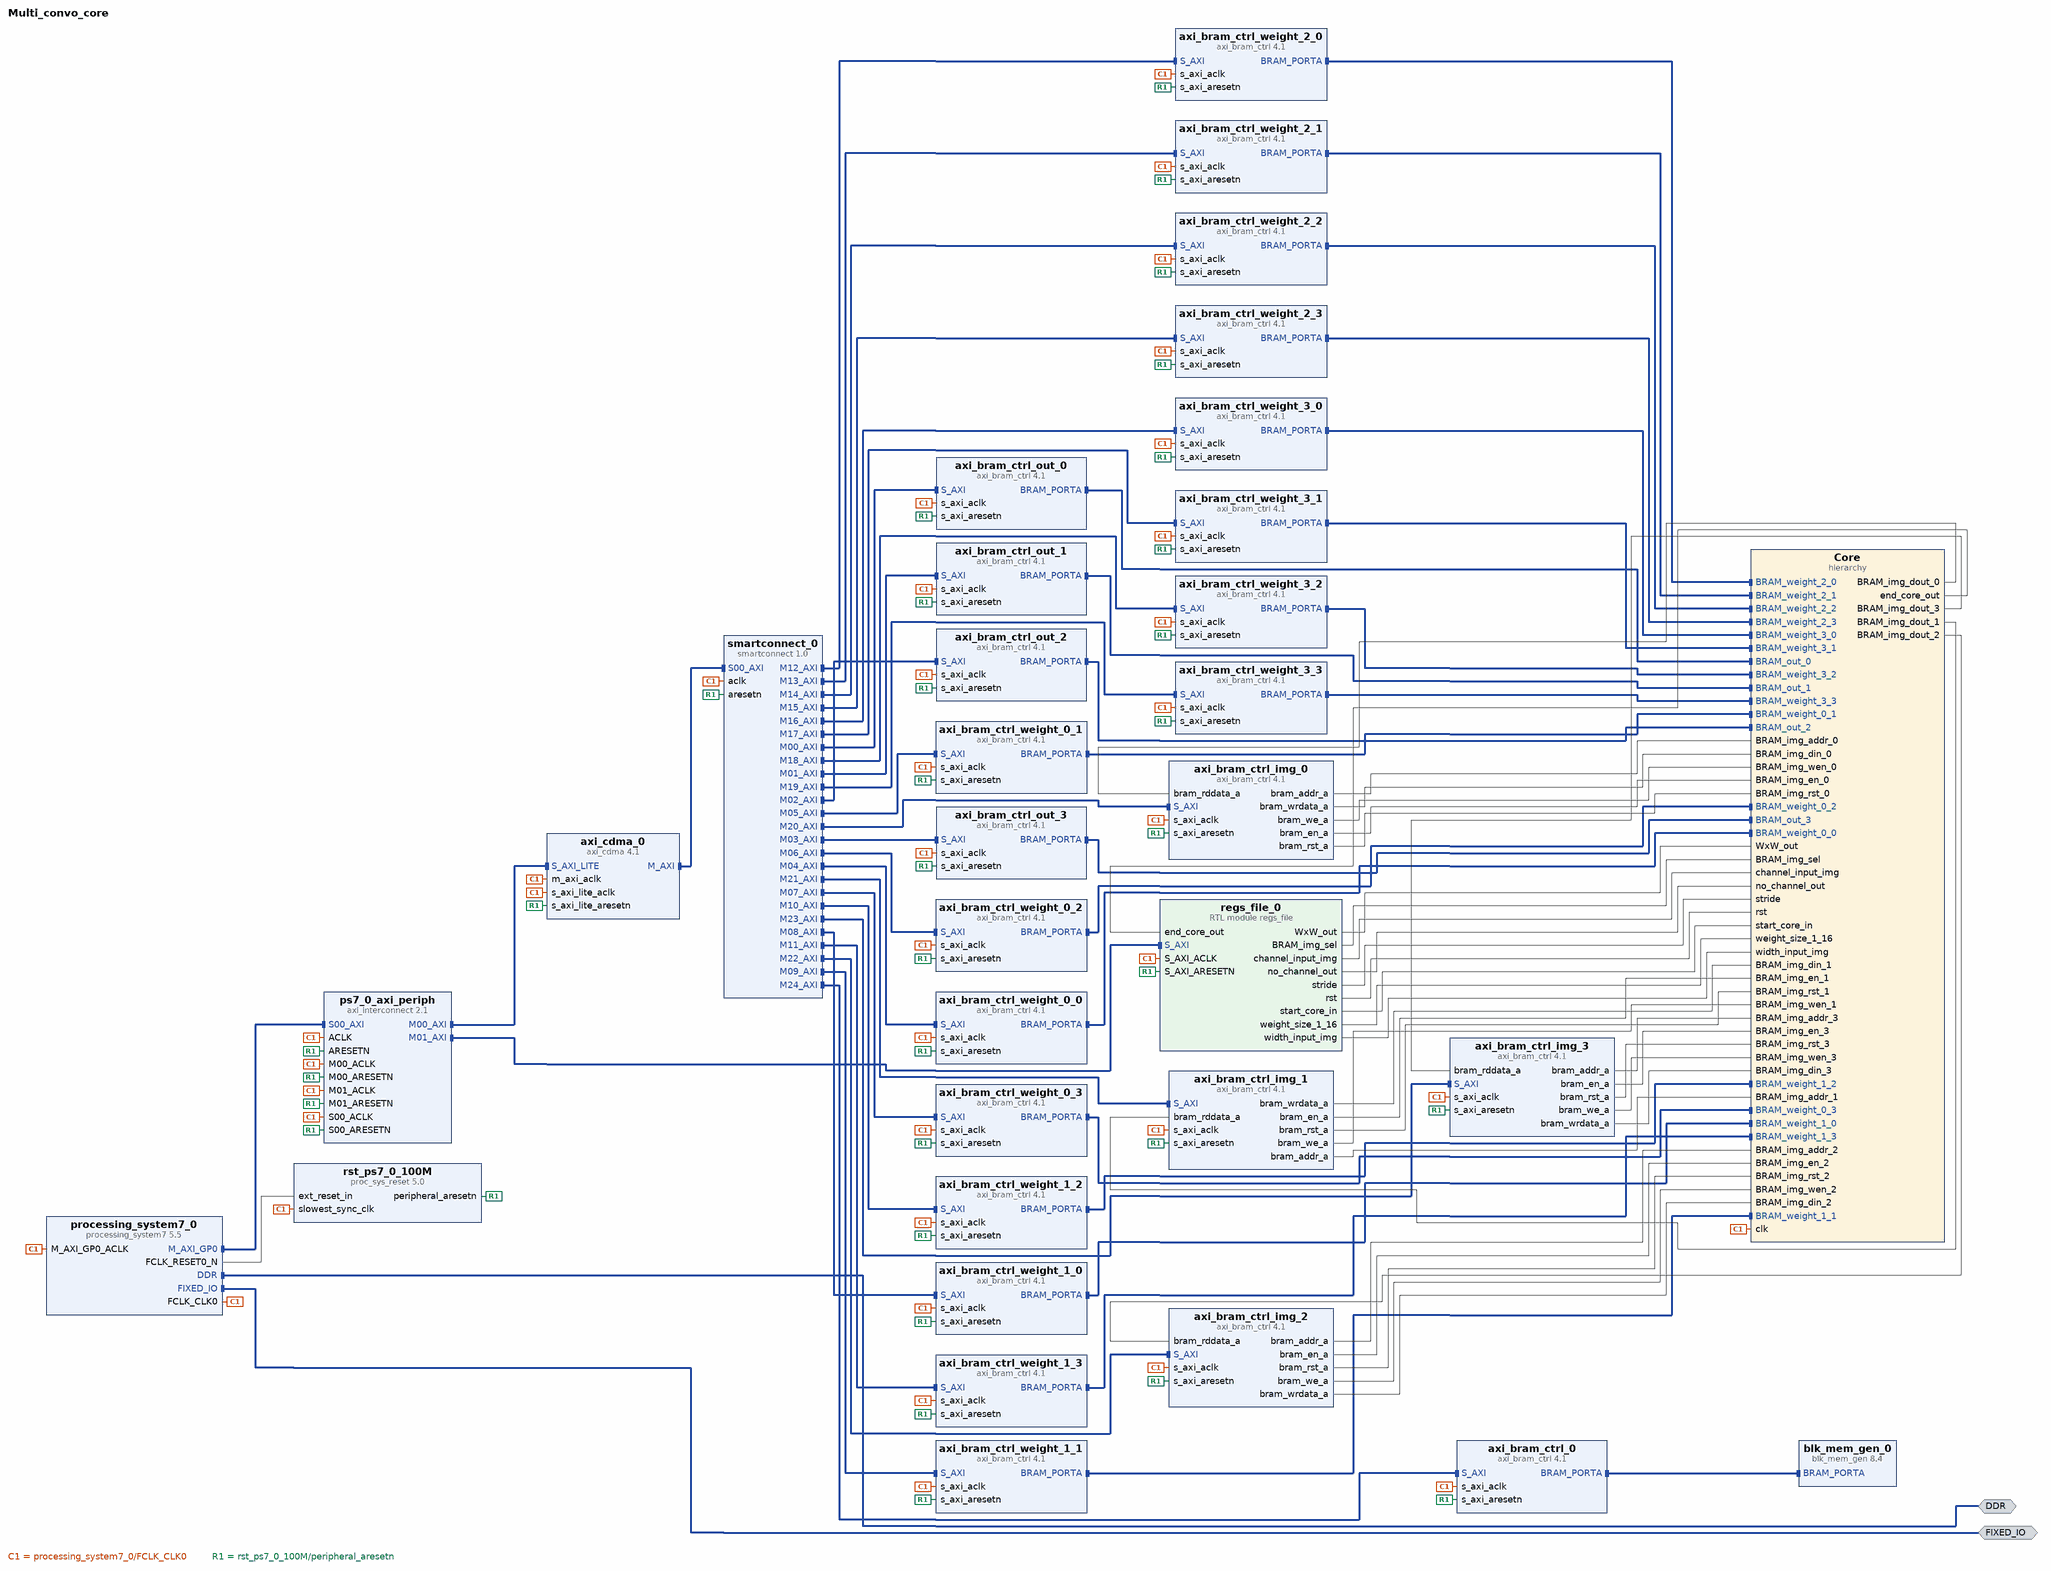
[diagram p0: block diagram of the top level]
# Vivado block design Multi_convo_core, xc7z020clg400-1, Vivado 2021.1
create_bd_design Multi_convo_core

create_bd_intf_port -mode Master -vlnv xilinx.com:interface:ddrx_rtl:1.0 DDR
create_bd_intf_port -mode Master -vlnv xilinx.com:display_processing_system7:fixedio_rtl:1.0 FIXED_IO

create_bd_cell -type hier Core
create_bd_cell -type ip -vlnv xilinx.com:ip:processing_system7:5.5 processing_system7_0
set_property -dict [list \
  CONFIG.PCW_APU_PERIPHERAL_FREQMHZ 650 \
  CONFIG.PCW_CRYSTAL_PERIPHERAL_FREQMHZ 50 \
  CONFIG.PCW_ENET0_ENET0_IO {MIO 16 .. 27} \
  CONFIG.PCW_ENET0_GRP_MDIO_ENABLE 1 \
  CONFIG.PCW_ENET0_GRP_MDIO_IO {MIO 52 .. 53} \
  CONFIG.PCW_ENET0_PERIPHERAL_ENABLE 1 \
  CONFIG.PCW_ENET0_RESET_ENABLE 1 \
  CONFIG.PCW_ENET0_RESET_IO {MIO 9} \
  CONFIG.PCW_ENET_RESET_ENABLE 1 \
  CONFIG.PCW_ENET_RESET_SELECT {Share reset pin} \
  CONFIG.PCW_FPGA0_PERIPHERAL_FREQMHZ 100 \
  CONFIG.PCW_FPGA1_PERIPHERAL_FREQMHZ 50 \
  CONFIG.PCW_GPIO_MIO_GPIO_ENABLE 1 \
  CONFIG.PCW_GPIO_MIO_GPIO_IO MIO \
  CONFIG.PCW_I2C_RESET_ENABLE 1 \
  CONFIG.PCW_M_AXI_GP0_FREQMHZ 10 \
  CONFIG.PCW_PERIPHERAL_BOARD_PRESET None \
  CONFIG.PCW_PRESET_BANK1_VOLTAGE {LVCMOS 1.8V} \
  CONFIG.PCW_QSPI_GRP_FBCLK_ENABLE 1 \
  CONFIG.PCW_QSPI_GRP_FBCLK_IO {MIO 8} \
  CONFIG.PCW_QSPI_GRP_SINGLE_SS_ENABLE 1 \
  CONFIG.PCW_QSPI_GRP_SINGLE_SS_IO {MIO 1 .. 6} \
  CONFIG.PCW_QSPI_PERIPHERAL_ENABLE 1 \
  CONFIG.PCW_QSPI_QSPI_IO {MIO 1 .. 6} \
  CONFIG.PCW_SD0_GRP_CD_ENABLE 1 \
  CONFIG.PCW_SD0_GRP_CD_IO {MIO 47} \
  CONFIG.PCW_SD0_GRP_WP_ENABLE 0 \
  CONFIG.PCW_SD0_PERIPHERAL_ENABLE 1 \
  CONFIG.PCW_SD0_SD0_IO {MIO 40 .. 45} \
  CONFIG.PCW_SDIO_PERIPHERAL_FREQMHZ 50 \
  CONFIG.PCW_SINGLE_QSPI_DATA_MODE x4 \
  CONFIG.PCW_UART0_PERIPHERAL_ENABLE 1 \
  CONFIG.PCW_UART0_UART0_IO {MIO 14 .. 15} \
  CONFIG.PCW_UART1_PERIPHERAL_ENABLE 0 \
  CONFIG.PCW_UART_PERIPHERAL_FREQMHZ 100 \
  CONFIG.PCW_UIPARAM_DDR_BUS_WIDTH {16 Bit} \
  CONFIG.PCW_UIPARAM_DDR_FREQ_MHZ 525 \
  CONFIG.PCW_UIPARAM_DDR_PARTNO {MT41J256M16 RE-125} \
  CONFIG.PCW_USB0_PERIPHERAL_ENABLE 1 \
  CONFIG.PCW_USB0_RESET_ENABLE 1 \
  CONFIG.PCW_USB0_RESET_IO {MIO 46} \
  CONFIG.PCW_USB0_USB0_IO {MIO 28 .. 39} \
  CONFIG.PCW_USB_RESET_ENABLE 1 \
  CONFIG.PCW_USB_RESET_SELECT {Share reset pin} \
] [get_bd_cells processing_system7_0]
# 481 more settings of processing_system7_0 are not shown: defaults, MIO pin electricals, DDR timing, and values the tool derives
create_bd_cell -type ip -vlnv xilinx.com:ip:axi_cdma:4.1 axi_cdma_0
set_property -dict {CONFIG.C_INCLUDE_SG 0 CONFIG.C_M_AXI_MAX_BURST_LEN 32} [get_bd_cells axi_cdma_0]
create_bd_cell -type ip -vlnv xilinx.com:ip:axi_bram_ctrl:4.1 axi_bram_ctrl_out_0
set_property -dict {CONFIG.SINGLE_PORT_BRAM 1} [get_bd_cells axi_bram_ctrl_out_0]
create_bd_cell -type ip -vlnv xilinx.com:ip:axi_interconnect:2.1 ps7_0_axi_periph
set_property -dict {CONFIG.NUM_MI 2} [get_bd_cells ps7_0_axi_periph]
create_bd_cell -type ip -vlnv xilinx.com:ip:proc_sys_reset:5.0 rst_ps7_0_100M
create_bd_cell -type ip -vlnv xilinx.com:ip:axi_bram_ctrl:4.1 axi_bram_ctrl_out_1
set_property -dict {CONFIG.SINGLE_PORT_BRAM 1} [get_bd_cells axi_bram_ctrl_out_1]
create_bd_cell -type ip -vlnv xilinx.com:ip:smartconnect:1.0 smartconnect_0
set_property -dict {CONFIG.NUM_MI 25 CONFIG.NUM_SI 1} [get_bd_cells smartconnect_0]
create_bd_cell -type ip -vlnv xilinx.com:ip:axi_bram_ctrl:4.1 axi_bram_ctrl_out_2
set_property -dict {CONFIG.SINGLE_PORT_BRAM 1} [get_bd_cells axi_bram_ctrl_out_2]
create_bd_cell -type ip -vlnv xilinx.com:ip:axi_bram_ctrl:4.1 axi_bram_ctrl_out_3
set_property -dict {CONFIG.SINGLE_PORT_BRAM 1} [get_bd_cells axi_bram_ctrl_out_3]
create_bd_cell -type ip -vlnv xilinx.com:ip:axi_bram_ctrl:4.1 axi_bram_ctrl_weight_0_0
set_property -dict {CONFIG.SINGLE_PORT_BRAM 1} [get_bd_cells axi_bram_ctrl_weight_0_0]
create_bd_cell -type ip -vlnv xilinx.com:ip:axi_bram_ctrl:4.1 axi_bram_ctrl_weight_0_2
set_property -dict {CONFIG.SINGLE_PORT_BRAM 1} [get_bd_cells axi_bram_ctrl_weight_0_2]
create_bd_cell -type ip -vlnv xilinx.com:ip:axi_bram_ctrl:4.1 axi_bram_ctrl_weight_0_1
set_property -dict {CONFIG.SINGLE_PORT_BRAM 1} [get_bd_cells axi_bram_ctrl_weight_0_1]
create_bd_cell -type ip -vlnv xilinx.com:ip:axi_bram_ctrl:4.1 axi_bram_ctrl_weight_0_3
set_property -dict {CONFIG.SINGLE_PORT_BRAM 1} [get_bd_cells axi_bram_ctrl_weight_0_3]
create_bd_cell -type ip -vlnv xilinx.com:ip:axi_bram_ctrl:4.1 axi_bram_ctrl_weight_1_0
set_property -dict {CONFIG.SINGLE_PORT_BRAM 1} [get_bd_cells axi_bram_ctrl_weight_1_0]
create_bd_cell -type ip -vlnv xilinx.com:ip:axi_bram_ctrl:4.1 axi_bram_ctrl_weight_1_1
set_property -dict {CONFIG.SINGLE_PORT_BRAM 1} [get_bd_cells axi_bram_ctrl_weight_1_1]
create_bd_cell -type ip -vlnv xilinx.com:ip:axi_bram_ctrl:4.1 axi_bram_ctrl_weight_1_2
set_property -dict {CONFIG.SINGLE_PORT_BRAM 1} [get_bd_cells axi_bram_ctrl_weight_1_2]
create_bd_cell -type ip -vlnv xilinx.com:ip:axi_bram_ctrl:4.1 axi_bram_ctrl_weight_1_3
set_property -dict {CONFIG.SINGLE_PORT_BRAM 1} [get_bd_cells axi_bram_ctrl_weight_1_3]
create_bd_cell -type ip -vlnv xilinx.com:ip:axi_bram_ctrl:4.1 axi_bram_ctrl_weight_2_0
set_property -dict {CONFIG.SINGLE_PORT_BRAM 1} [get_bd_cells axi_bram_ctrl_weight_2_0]
create_bd_cell -type ip -vlnv xilinx.com:ip:axi_bram_ctrl:4.1 axi_bram_ctrl_weight_2_1
set_property -dict {CONFIG.SINGLE_PORT_BRAM 1} [get_bd_cells axi_bram_ctrl_weight_2_1]
create_bd_cell -type ip -vlnv xilinx.com:ip:axi_bram_ctrl:4.1 axi_bram_ctrl_weight_2_2
set_property -dict {CONFIG.SINGLE_PORT_BRAM 1} [get_bd_cells axi_bram_ctrl_weight_2_2]
create_bd_cell -type ip -vlnv xilinx.com:ip:axi_bram_ctrl:4.1 axi_bram_ctrl_weight_2_3
set_property -dict {CONFIG.SINGLE_PORT_BRAM 1} [get_bd_cells axi_bram_ctrl_weight_2_3]
create_bd_cell -type ip -vlnv xilinx.com:ip:axi_bram_ctrl:4.1 axi_bram_ctrl_weight_3_0
set_property -dict {CONFIG.SINGLE_PORT_BRAM 1} [get_bd_cells axi_bram_ctrl_weight_3_0]
create_bd_cell -type ip -vlnv xilinx.com:ip:axi_bram_ctrl:4.1 axi_bram_ctrl_weight_3_1
set_property -dict {CONFIG.SINGLE_PORT_BRAM 1} [get_bd_cells axi_bram_ctrl_weight_3_1]
create_bd_cell -type ip -vlnv xilinx.com:ip:axi_bram_ctrl:4.1 axi_bram_ctrl_weight_3_2
set_property -dict {CONFIG.SINGLE_PORT_BRAM 1} [get_bd_cells axi_bram_ctrl_weight_3_2]
create_bd_cell -type ip -vlnv xilinx.com:ip:axi_bram_ctrl:4.1 axi_bram_ctrl_weight_3_3
set_property -dict {CONFIG.SINGLE_PORT_BRAM 1} [get_bd_cells axi_bram_ctrl_weight_3_3]
create_bd_cell -type ip -vlnv xilinx.com:ip:axi_bram_ctrl:4.1 axi_bram_ctrl_img_0
set_property -dict {CONFIG.SINGLE_PORT_BRAM 1} [get_bd_cells axi_bram_ctrl_img_0]
create_bd_cell -type ip -vlnv xilinx.com:ip:axi_bram_ctrl:4.1 axi_bram_ctrl_img_1
set_property -dict {CONFIG.SINGLE_PORT_BRAM 1} [get_bd_cells axi_bram_ctrl_img_1]
create_bd_cell -type ip -vlnv xilinx.com:ip:axi_bram_ctrl:4.1 axi_bram_ctrl_img_2
set_property -dict {CONFIG.SINGLE_PORT_BRAM 1} [get_bd_cells axi_bram_ctrl_img_2]
create_bd_cell -type ip -vlnv xilinx.com:ip:axi_bram_ctrl:4.1 axi_bram_ctrl_img_3
set_property -dict {CONFIG.SINGLE_PORT_BRAM 1} [get_bd_cells axi_bram_ctrl_img_3]
create_bd_cell -type module -reference regs_file regs_file_0
create_bd_cell -type ip -vlnv xilinx.com:ip:blk_mem_gen:8.4 blk_mem_gen_0
set_property -dict {CONFIG.EN_SAFETY_CKT false} [get_bd_cells blk_mem_gen_0]
create_bd_cell -type ip -vlnv xilinx.com:ip:axi_bram_ctrl:4.1 axi_bram_ctrl_0
set_property -dict {CONFIG.SINGLE_PORT_BRAM 1} [get_bd_cells axi_bram_ctrl_0]

# ---- hierarchy /Core ----
current_bd_instance /Core
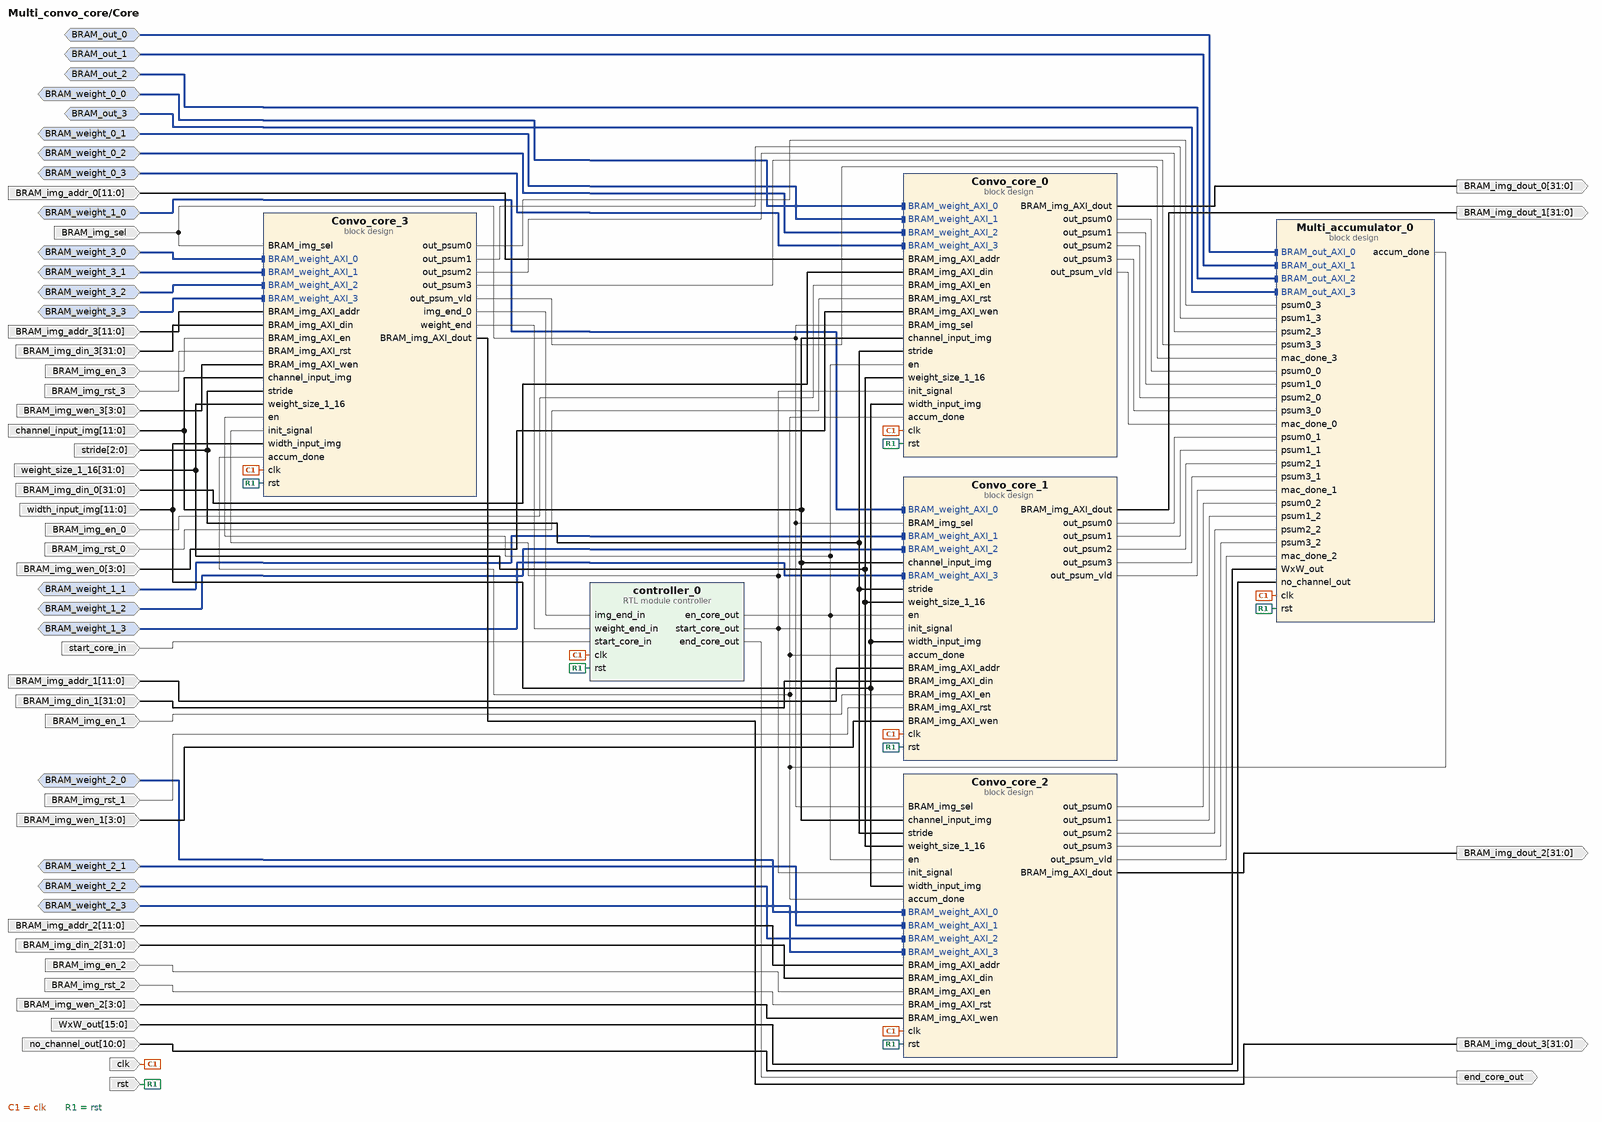
[diagram p1: block diagram inside /Core]
create_bd_intf_pin -mode Slave -vlnv xilinx.com:interface:bram_rtl:1.0 BRAM_weight_0_1
create_bd_intf_pin -mode Slave -vlnv xilinx.com:interface:bram_rtl:1.0 BRAM_weight_0_0
create_bd_intf_pin -mode Slave -vlnv xilinx.com:interface:bram_rtl:1.0 BRAM_weight_0_2
create_bd_intf_pin -mode Slave -vlnv xilinx.com:interface:bram_rtl:1.0 BRAM_weight_0_3
create_bd_intf_pin -mode Slave -vlnv xilinx.com:interface:bram_rtl:1.0 BRAM_weight_1_1
create_bd_intf_pin -mode Slave -vlnv xilinx.com:interface:bram_rtl:1.0 BRAM_weight_1_0
create_bd_intf_pin -mode Slave -vlnv xilinx.com:interface:bram_rtl:1.0 BRAM_weight_1_2
create_bd_intf_pin -mode Slave -vlnv xilinx.com:interface:bram_rtl:1.0 BRAM_weight_1_3
create_bd_intf_pin -mode Slave -vlnv xilinx.com:interface:bram_rtl:1.0 BRAM_out_0
create_bd_intf_pin -mode Slave -vlnv xilinx.com:interface:bram_rtl:1.0 BRAM_out_1
create_bd_intf_pin -mode Slave -vlnv xilinx.com:interface:bram_rtl:1.0 BRAM_out_2
create_bd_intf_pin -mode Slave -vlnv xilinx.com:interface:bram_rtl:1.0 BRAM_out_3
create_bd_intf_pin -mode Slave -vlnv xilinx.com:interface:bram_rtl:1.0 BRAM_weight_2_1
create_bd_intf_pin -mode Slave -vlnv xilinx.com:interface:bram_rtl:1.0 BRAM_weight_2_0
create_bd_intf_pin -mode Slave -vlnv xilinx.com:interface:bram_rtl:1.0 BRAM_weight_2_2
create_bd_intf_pin -mode Slave -vlnv xilinx.com:interface:bram_rtl:1.0 BRAM_weight_2_3
create_bd_intf_pin -mode Slave -vlnv xilinx.com:interface:bram_rtl:1.0 BRAM_weight_3_1
create_bd_intf_pin -mode Slave -vlnv xilinx.com:interface:bram_rtl:1.0 BRAM_weight_3_0
create_bd_intf_pin -mode Slave -vlnv xilinx.com:interface:bram_rtl:1.0 BRAM_weight_3_2
create_bd_intf_pin -mode Slave -vlnv xilinx.com:interface:bram_rtl:1.0 BRAM_weight_3_3
create_bd_pin -dir I -type clk clk
create_bd_pin -dir I -type rst rst
create_bd_pin -dir I start_core_in
create_bd_pin -dir O end_core_out
create_bd_pin -dir I -from 2 -to 0 stride
create_bd_pin -dir I -from 11 -to 0 width_input_img
create_bd_pin -dir I -from 11 -to 0 channel_input_img
create_bd_pin -dir I -from 31 -to 0 weight_size_1_16
create_bd_pin -dir I BRAM_img_sel
create_bd_pin -dir I -from 11 -to 0 BRAM_img_addr_0
create_bd_pin -dir I -from 31 -to 0 BRAM_img_din_0
create_bd_pin -dir O -from 31 -to 0 BRAM_img_dout_0
create_bd_pin -dir I BRAM_img_en_0
create_bd_pin -dir I -type rst BRAM_img_rst_0
create_bd_pin -dir I -from 3 -to 0 BRAM_img_wen_0
create_bd_pin -dir I -from 11 -to 0 BRAM_img_addr_1
create_bd_pin -dir I -from 31 -to 0 BRAM_img_din_1
create_bd_pin -dir O -from 31 -to 0 BRAM_img_dout_1
create_bd_pin -dir I BRAM_img_en_1
create_bd_pin -dir I -type rst BRAM_img_rst_1
create_bd_pin -dir I -from 3 -to 0 BRAM_img_wen_1
create_bd_pin -dir I -from 15 -to 0 WxW_out
create_bd_pin -dir I -from 10 -to 0 no_channel_out
create_bd_pin -dir I -from 11 -to 0 BRAM_img_addr_2
create_bd_pin -dir I -from 31 -to 0 BRAM_img_din_2
create_bd_pin -dir O -from 31 -to 0 BRAM_img_dout_2
create_bd_pin -dir I BRAM_img_en_2
create_bd_pin -dir I -type rst BRAM_img_rst_2
create_bd_pin -dir I -from 3 -to 0 BRAM_img_wen_2
create_bd_pin -dir I -from 11 -to 0 BRAM_img_addr_3
create_bd_pin -dir I -from 31 -to 0 BRAM_img_din_3
create_bd_pin -dir O -from 31 -to 0 BRAM_img_dout_3
create_bd_pin -dir I BRAM_img_en_3
create_bd_pin -dir I -type rst BRAM_img_rst_3
create_bd_pin -dir I -from 3 -to 0 BRAM_img_wen_3

create_bd_cell -type module -reference controller controller_0
create_bd_cell -type container -reference Convo_core Convo_core_0
set_property -dict [list \
  CONFIG.ACTIVE_SIM_BD Convo_core.bd \
  CONFIG.ACTIVE_SYNTH_BD Convo_core.bd \
  CONFIG.ENABLE_DFX 0 \
  CONFIG.LIST_SIM_BD Convo_core.bd \
  CONFIG.LIST_SYNTH_BD Convo_core.bd \
  CONFIG.LOCK_PROPAGATE 0 \
] [get_bd_cells Convo_core_0]
create_bd_cell -type container -reference Convo_core Convo_core_1
set_property -dict [list \
  CONFIG.ACTIVE_SIM_BD Convo_core.bd \
  CONFIG.ACTIVE_SYNTH_BD Convo_core.bd \
  CONFIG.ENABLE_DFX 0 \
  CONFIG.LIST_SIM_BD Convo_core.bd \
  CONFIG.LIST_SYNTH_BD Convo_core.bd \
  CONFIG.LOCK_PROPAGATE 0 \
] [get_bd_cells Convo_core_1]
create_bd_cell -type container -reference Multi_accumulator Multi_accumulator_0
set_property -dict [list \
  CONFIG.ACTIVE_SIM_BD Multi_accumulator.bd \
  CONFIG.ACTIVE_SYNTH_BD Multi_accumulator.bd \
  CONFIG.ENABLE_DFX 0 \
  CONFIG.LIST_SIM_BD Multi_accumulator.bd \
  CONFIG.LIST_SYNTH_BD Multi_accumulator.bd \
  CONFIG.LOCK_PROPAGATE 0 \
] [get_bd_cells Multi_accumulator_0]
create_bd_cell -type container -reference Convo_core Convo_core_2
set_property -dict [list \
  CONFIG.ACTIVE_SIM_BD Convo_core.bd \
  CONFIG.ACTIVE_SYNTH_BD Convo_core.bd \
  CONFIG.ENABLE_DFX 0 \
  CONFIG.LIST_SIM_BD Convo_core.bd \
  CONFIG.LIST_SYNTH_BD Convo_core.bd \
  CONFIG.LOCK_PROPAGATE 0 \
] [get_bd_cells Convo_core_2]
create_bd_cell -type container -reference Convo_core Convo_core_3
set_property -dict [list \
  CONFIG.ACTIVE_SIM_BD Convo_core.bd \
  CONFIG.ACTIVE_SYNTH_BD Convo_core.bd \
  CONFIG.ENABLE_DFX 0 \
  CONFIG.LIST_SIM_BD Convo_core.bd \
  CONFIG.LIST_SYNTH_BD Convo_core.bd \
  CONFIG.LOCK_PROPAGATE 0 \
] [get_bd_cells Convo_core_3]

# ---- connections ----

current_bd_instance /Core
connect_bd_intf_net [get_bd_intf_pins BRAM_out_0] [get_bd_intf_pins Multi_accumulator_0/BRAM_out_AXI_0]
connect_bd_intf_net [get_bd_intf_pins BRAM_out_1] [get_bd_intf_pins Multi_accumulator_0/BRAM_out_AXI_1]
connect_bd_intf_net [get_bd_intf_pins BRAM_out_2] [get_bd_intf_pins Multi_accumulator_0/BRAM_out_AXI_2]
connect_bd_intf_net [get_bd_intf_pins BRAM_out_3] [get_bd_intf_pins Multi_accumulator_0/BRAM_out_AXI_3]
connect_bd_intf_net [get_bd_intf_pins BRAM_weight_0_0] [get_bd_intf_pins Convo_core_0/BRAM_weight_AXI_0]
connect_bd_intf_net [get_bd_intf_pins BRAM_weight_3_0] [get_bd_intf_pins Convo_core_3/BRAM_weight_AXI_0]
connect_bd_intf_net [get_bd_intf_pins BRAM_weight_2_0] [get_bd_intf_pins Convo_core_2/BRAM_weight_AXI_0]
connect_bd_intf_net [get_bd_intf_pins BRAM_weight_1_0] [get_bd_intf_pins Convo_core_1/BRAM_weight_AXI_0]
connect_bd_intf_net [get_bd_intf_pins BRAM_weight_0_1] [get_bd_intf_pins Convo_core_0/BRAM_weight_AXI_1]
connect_bd_intf_net [get_bd_intf_pins BRAM_weight_3_1] [get_bd_intf_pins Convo_core_3/BRAM_weight_AXI_1]
connect_bd_intf_net [get_bd_intf_pins BRAM_weight_2_1] [get_bd_intf_pins Convo_core_2/BRAM_weight_AXI_1]
connect_bd_intf_net [get_bd_intf_pins BRAM_weight_1_1] [get_bd_intf_pins Convo_core_1/BRAM_weight_AXI_1]
connect_bd_intf_net [get_bd_intf_pins BRAM_weight_2_2] [get_bd_intf_pins Convo_core_2/BRAM_weight_AXI_2]
connect_bd_intf_net [get_bd_intf_pins BRAM_weight_1_2] [get_bd_intf_pins Convo_core_1/BRAM_weight_AXI_2]
connect_bd_intf_net [get_bd_intf_pins BRAM_weight_0_2] [get_bd_intf_pins Convo_core_0/BRAM_weight_AXI_2]
connect_bd_intf_net [get_bd_intf_pins BRAM_weight_3_2] [get_bd_intf_pins Convo_core_3/BRAM_weight_AXI_2]
connect_bd_intf_net [get_bd_intf_pins BRAM_weight_2_3] [get_bd_intf_pins Convo_core_2/BRAM_weight_AXI_3]
connect_bd_intf_net [get_bd_intf_pins BRAM_weight_1_3] [get_bd_intf_pins Convo_core_1/BRAM_weight_AXI_3]
connect_bd_intf_net [get_bd_intf_pins BRAM_weight_0_3] [get_bd_intf_pins Convo_core_0/BRAM_weight_AXI_3]
connect_bd_intf_net [get_bd_intf_pins BRAM_weight_3_3] [get_bd_intf_pins Convo_core_3/BRAM_weight_AXI_3]
connect_bd_net -net BRAM_img_AXI_addr_0_1 [get_bd_pins BRAM_img_addr_0] [get_bd_pins Convo_core_0/BRAM_img_AXI_addr]
connect_bd_net -net BRAM_img_AXI_addr_0_2 [get_bd_pins BRAM_img_addr_1] [get_bd_pins Convo_core_1/BRAM_img_AXI_addr]
connect_bd_net -net BRAM_img_AXI_addr_0_3 [get_bd_pins BRAM_img_addr_2] [get_bd_pins Convo_core_2/BRAM_img_AXI_addr]
connect_bd_net -net BRAM_img_AXI_addr_0_4 [get_bd_pins BRAM_img_addr_3] [get_bd_pins Convo_core_3/BRAM_img_AXI_addr]
connect_bd_net -net BRAM_img_AXI_din_0_1 [get_bd_pins BRAM_img_din_0] [get_bd_pins Convo_core_0/BRAM_img_AXI_din]
connect_bd_net -net BRAM_img_AXI_din_0_2 [get_bd_pins BRAM_img_din_1] [get_bd_pins Convo_core_1/BRAM_img_AXI_din]
connect_bd_net -net BRAM_img_AXI_din_0_3 [get_bd_pins BRAM_img_din_2] [get_bd_pins Convo_core_2/BRAM_img_AXI_din]
connect_bd_net -net BRAM_img_AXI_din_0_4 [get_bd_pins BRAM_img_din_3] [get_bd_pins Convo_core_3/BRAM_img_AXI_din]
connect_bd_net -net BRAM_img_AXI_en_0_1 [get_bd_pins BRAM_img_en_0] [get_bd_pins Convo_core_0/BRAM_img_AXI_en]
connect_bd_net -net BRAM_img_AXI_en_0_2 [get_bd_pins BRAM_img_en_1] [get_bd_pins Convo_core_1/BRAM_img_AXI_en]
connect_bd_net -net BRAM_img_AXI_en_0_3 [get_bd_pins BRAM_img_en_2] [get_bd_pins Convo_core_2/BRAM_img_AXI_en]
connect_bd_net -net BRAM_img_AXI_en_0_4 [get_bd_pins BRAM_img_en_3] [get_bd_pins Convo_core_3/BRAM_img_AXI_en]
connect_bd_net -net BRAM_img_AXI_rst_0_1 [get_bd_pins BRAM_img_rst_0] [get_bd_pins Convo_core_0/BRAM_img_AXI_rst]
connect_bd_net -net BRAM_img_AXI_rst_0_2 [get_bd_pins BRAM_img_rst_1] [get_bd_pins Convo_core_1/BRAM_img_AXI_rst]
connect_bd_net -net BRAM_img_AXI_rst_0_3 [get_bd_pins BRAM_img_rst_2] [get_bd_pins Convo_core_2/BRAM_img_AXI_rst]
connect_bd_net -net BRAM_img_AXI_rst_0_4 [get_bd_pins BRAM_img_rst_3] [get_bd_pins Convo_core_3/BRAM_img_AXI_rst]
connect_bd_net -net BRAM_img_AXI_wen_0_1 [get_bd_pins BRAM_img_wen_0] [get_bd_pins Convo_core_0/BRAM_img_AXI_wen]
connect_bd_net -net BRAM_img_AXI_wen_0_2 [get_bd_pins BRAM_img_wen_1] [get_bd_pins Convo_core_1/BRAM_img_AXI_wen]
connect_bd_net -net BRAM_img_AXI_wen_0_3 [get_bd_pins BRAM_img_wen_2] [get_bd_pins Convo_core_2/BRAM_img_AXI_wen]
connect_bd_net -net BRAM_img_AXI_wen_0_4 [get_bd_pins BRAM_img_wen_3] [get_bd_pins Convo_core_3/BRAM_img_AXI_wen]
connect_bd_net -net BRAM_img_sel_0_1 [get_bd_pins BRAM_img_sel] \
  [get_bd_pins Convo_core_1/BRAM_img_sel] [get_bd_pins Convo_core_2/BRAM_img_sel] [get_bd_pins Convo_core_3/BRAM_img_sel] \
  [get_bd_pins Convo_core_0/BRAM_img_sel]
connect_bd_net [get_bd_pins Convo_core_0/BRAM_img_AXI_dout] [get_bd_pins BRAM_img_dout_0]
connect_bd_net [get_bd_pins Convo_core_0/out_psum0] [get_bd_pins Multi_accumulator_0/psum0_0]
connect_bd_net [get_bd_pins Convo_core_0/out_psum1] [get_bd_pins Multi_accumulator_0/psum1_0]
connect_bd_net [get_bd_pins Convo_core_0/out_psum2] [get_bd_pins Multi_accumulator_0/psum2_0]
connect_bd_net [get_bd_pins Convo_core_0/out_psum3] [get_bd_pins Multi_accumulator_0/psum3_0]
connect_bd_net [get_bd_pins Convo_core_1/BRAM_img_AXI_dout] [get_bd_pins BRAM_img_dout_1]
connect_bd_net [get_bd_pins Convo_core_1/out_psum0] [get_bd_pins Multi_accumulator_0/psum0_1]
connect_bd_net [get_bd_pins Convo_core_1/out_psum1] [get_bd_pins Multi_accumulator_0/psum1_1]
connect_bd_net [get_bd_pins Convo_core_1/out_psum2] [get_bd_pins Multi_accumulator_0/psum2_1]
connect_bd_net [get_bd_pins Convo_core_1/out_psum3] [get_bd_pins Multi_accumulator_0/psum3_1]
connect_bd_net [get_bd_pins Convo_core_2/BRAM_img_AXI_dout] [get_bd_pins BRAM_img_dout_2]
connect_bd_net [get_bd_pins Convo_core_2/out_psum0] [get_bd_pins Multi_accumulator_0/psum0_2]
connect_bd_net [get_bd_pins Convo_core_2/out_psum1] [get_bd_pins Multi_accumulator_0/psum1_2]
connect_bd_net [get_bd_pins Convo_core_2/out_psum2] [get_bd_pins Multi_accumulator_0/psum2_2]
connect_bd_net [get_bd_pins Convo_core_2/out_psum3] [get_bd_pins Multi_accumulator_0/psum3_2]
connect_bd_net [get_bd_pins Convo_core_2/out_psum_vld] [get_bd_pins Multi_accumulator_0/mac_done_2]
connect_bd_net [get_bd_pins Convo_core_3/BRAM_img_AXI_dout] [get_bd_pins BRAM_img_dout_3]
connect_bd_net [get_bd_pins Convo_core_3/img_end_0] [get_bd_pins controller_0/img_end_in]
connect_bd_net [get_bd_pins Convo_core_3/out_psum0] [get_bd_pins Multi_accumulator_0/psum0_3]
connect_bd_net [get_bd_pins Convo_core_3/out_psum1] [get_bd_pins Multi_accumulator_0/psum1_3]
connect_bd_net [get_bd_pins Convo_core_3/out_psum2] [get_bd_pins Multi_accumulator_0/psum2_3]
connect_bd_net [get_bd_pins Convo_core_3/out_psum3] [get_bd_pins Multi_accumulator_0/psum3_3]
connect_bd_net [get_bd_pins Convo_core_3/weight_end] [get_bd_pins controller_0/weight_end_in]
connect_bd_net [get_bd_pins Multi_accumulator_0/accum_done] \
  [get_bd_pins Convo_core_0/accum_done] [get_bd_pins Convo_core_1/accum_done] [get_bd_pins Convo_core_2/accum_done] \
  [get_bd_pins Convo_core_3/accum_done]
connect_bd_net -net WxW_out_0_1 [get_bd_pins WxW_out] [get_bd_pins Multi_accumulator_0/WxW_out]
connect_bd_net -net channel_input_img_0_1 [get_bd_pins channel_input_img] \
  [get_bd_pins Convo_core_1/channel_input_img] [get_bd_pins Convo_core_2/channel_input_img] \
  [get_bd_pins Convo_core_3/channel_input_img] [get_bd_pins Convo_core_0/channel_input_img]
connect_bd_net -net clk_0_1 [get_bd_pins clk] \
  [get_bd_pins Convo_core_0/clk] [get_bd_pins Convo_core_1/clk] [get_bd_pins Convo_core_2/clk] [get_bd_pins Convo_core_3/clk] \
  [get_bd_pins Multi_accumulator_0/clk] [get_bd_pins controller_0/clk]
connect_bd_net [get_bd_pins controller_0/end_core_out] [get_bd_pins end_core_out]
connect_bd_net -net en_0_1 [get_bd_pins controller_0/en_core_out] \
  [get_bd_pins Convo_core_0/en] [get_bd_pins Convo_core_1/en] [get_bd_pins Convo_core_2/en] [get_bd_pins Convo_core_3/en]
connect_bd_net -net init_signal_0_1 [get_bd_pins controller_0/start_core_out] \
  [get_bd_pins Convo_core_0/init_signal] [get_bd_pins Convo_core_1/init_signal] [get_bd_pins Convo_core_2/init_signal] \
  [get_bd_pins Convo_core_3/init_signal]
connect_bd_net -net mac_done_0_1 [get_bd_pins Convo_core_0/out_psum_vld] [get_bd_pins Multi_accumulator_0/mac_done_0]
connect_bd_net -net mac_done_1_1 [get_bd_pins Convo_core_1/out_psum_vld] [get_bd_pins Multi_accumulator_0/mac_done_1]
connect_bd_net -net mac_done_3_1 [get_bd_pins Convo_core_3/out_psum_vld] [get_bd_pins Multi_accumulator_0/mac_done_3]
connect_bd_net -net no_channel_out_0_1 [get_bd_pins no_channel_out] [get_bd_pins Multi_accumulator_0/no_channel_out]
connect_bd_net -net rst_0_1 [get_bd_pins rst] \
  [get_bd_pins Convo_core_0/rst] [get_bd_pins Convo_core_1/rst] [get_bd_pins Convo_core_2/rst] [get_bd_pins Convo_core_3/rst] \
  [get_bd_pins Multi_accumulator_0/rst] [get_bd_pins controller_0/rst]
connect_bd_net -net start_core_in_0_1 [get_bd_pins start_core_in] [get_bd_pins controller_0/start_core_in]
connect_bd_net -net stride_0_1 [get_bd_pins stride] \
  [get_bd_pins Convo_core_1/stride] [get_bd_pins Convo_core_2/stride] [get_bd_pins Convo_core_3/stride] \
  [get_bd_pins Convo_core_0/stride]
connect_bd_net -net weight_size_1_16_0_1 [get_bd_pins weight_size_1_16] \
  [get_bd_pins Convo_core_1/weight_size_1_16] [get_bd_pins Convo_core_2/weight_size_1_16] \
  [get_bd_pins Convo_core_3/weight_size_1_16] [get_bd_pins Convo_core_0/weight_size_1_16]
connect_bd_net -net width_input_img_0_1 [get_bd_pins width_input_img] \
  [get_bd_pins Convo_core_1/width_input_img] [get_bd_pins Convo_core_2/width_input_img] \
  [get_bd_pins Convo_core_3/width_input_img] [get_bd_pins Convo_core_0/width_input_img]

current_bd_instance /
connect_bd_intf_net [get_bd_intf_pins Core/BRAM_out_0] [get_bd_intf_pins axi_bram_ctrl_out_0/BRAM_PORTA]
connect_bd_intf_net [get_bd_intf_pins Core/BRAM_weight_0_1] [get_bd_intf_pins axi_bram_ctrl_weight_0_1/BRAM_PORTA]
connect_bd_intf_net [get_bd_intf_pins Core/BRAM_weight_0_2] [get_bd_intf_pins axi_bram_ctrl_weight_0_2/BRAM_PORTA]
connect_bd_intf_net [get_bd_intf_pins axi_bram_ctrl_0/BRAM_PORTA] [get_bd_intf_pins blk_mem_gen_0/BRAM_PORTA]
connect_bd_intf_net [get_bd_intf_pins axi_bram_ctrl_weight_1_2/BRAM_PORTA] [get_bd_intf_pins Core/BRAM_weight_1_2]
connect_bd_intf_net [get_bd_intf_pins axi_bram_ctrl_weight_1_3/BRAM_PORTA] [get_bd_intf_pins Core/BRAM_weight_1_3]
connect_bd_intf_net [get_bd_intf_pins axi_bram_ctrl_weight_2_0/BRAM_PORTA] [get_bd_intf_pins Core/BRAM_weight_2_0]
connect_bd_intf_net [get_bd_intf_pins axi_bram_ctrl_weight_2_1/BRAM_PORTA] [get_bd_intf_pins Core/BRAM_weight_2_1]
connect_bd_intf_net [get_bd_intf_pins axi_bram_ctrl_weight_2_2/BRAM_PORTA] [get_bd_intf_pins Core/BRAM_weight_2_2]
connect_bd_intf_net [get_bd_intf_pins axi_bram_ctrl_weight_2_3/BRAM_PORTA] [get_bd_intf_pins Core/BRAM_weight_2_3]
connect_bd_intf_net [get_bd_intf_pins axi_bram_ctrl_weight_3_0/BRAM_PORTA] [get_bd_intf_pins Core/BRAM_weight_3_0]
connect_bd_intf_net [get_bd_intf_pins axi_bram_ctrl_weight_3_1/BRAM_PORTA] [get_bd_intf_pins Core/BRAM_weight_3_1]
connect_bd_intf_net [get_bd_intf_pins axi_bram_ctrl_weight_3_2/BRAM_PORTA] [get_bd_intf_pins Core/BRAM_weight_3_2]
connect_bd_intf_net [get_bd_intf_pins axi_bram_ctrl_weight_3_3/BRAM_PORTA] [get_bd_intf_pins Core/BRAM_weight_3_3]
connect_bd_intf_net [get_bd_intf_pins axi_bram_ctrl_out_1/BRAM_PORTA] [get_bd_intf_pins Core/BRAM_out_1]
connect_bd_intf_net [get_bd_intf_pins axi_bram_ctrl_out_2/BRAM_PORTA] [get_bd_intf_pins Core/BRAM_out_2]
connect_bd_intf_net [get_bd_intf_pins axi_bram_ctrl_out_3/BRAM_PORTA] [get_bd_intf_pins Core/BRAM_out_3]
connect_bd_intf_net [get_bd_intf_pins axi_bram_ctrl_weight_0_0/BRAM_PORTA] [get_bd_intf_pins Core/BRAM_weight_0_0]
connect_bd_intf_net [get_bd_intf_pins axi_bram_ctrl_weight_0_3/BRAM_PORTA] [get_bd_intf_pins Core/BRAM_weight_0_3]
connect_bd_intf_net [get_bd_intf_pins axi_bram_ctrl_weight_1_0/BRAM_PORTA] [get_bd_intf_pins Core/BRAM_weight_1_0]
connect_bd_intf_net [get_bd_intf_pins axi_bram_ctrl_weight_1_1/BRAM_PORTA] [get_bd_intf_pins Core/BRAM_weight_1_1]
connect_bd_intf_net [get_bd_intf_pins axi_cdma_0/M_AXI] [get_bd_intf_pins smartconnect_0/S00_AXI]
connect_bd_intf_net [get_bd_intf_ports DDR] [get_bd_intf_pins processing_system7_0/DDR]
connect_bd_intf_net [get_bd_intf_ports FIXED_IO] [get_bd_intf_pins processing_system7_0/FIXED_IO]
connect_bd_intf_net [get_bd_intf_pins processing_system7_0/M_AXI_GP0] [get_bd_intf_pins ps7_0_axi_periph/S00_AXI]
connect_bd_intf_net [get_bd_intf_pins ps7_0_axi_periph/M00_AXI] [get_bd_intf_pins axi_cdma_0/S_AXI_LITE]
connect_bd_intf_net [get_bd_intf_pins ps7_0_axi_periph/M01_AXI] [get_bd_intf_pins regs_file_0/S_AXI]
connect_bd_intf_net [get_bd_intf_pins smartconnect_0/M00_AXI] [get_bd_intf_pins axi_bram_ctrl_out_0/S_AXI]
connect_bd_intf_net [get_bd_intf_pins smartconnect_0/M01_AXI] [get_bd_intf_pins axi_bram_ctrl_out_1/S_AXI]
connect_bd_intf_net [get_bd_intf_pins smartconnect_0/M02_AXI] [get_bd_intf_pins axi_bram_ctrl_out_2/S_AXI]
connect_bd_intf_net [get_bd_intf_pins smartconnect_0/M03_AXI] [get_bd_intf_pins axi_bram_ctrl_out_3/S_AXI]
connect_bd_intf_net [get_bd_intf_pins smartconnect_0/M04_AXI] [get_bd_intf_pins axi_bram_ctrl_weight_0_0/S_AXI]
connect_bd_intf_net [get_bd_intf_pins smartconnect_0/M05_AXI] [get_bd_intf_pins axi_bram_ctrl_weight_0_1/S_AXI]
connect_bd_intf_net [get_bd_intf_pins smartconnect_0/M06_AXI] [get_bd_intf_pins axi_bram_ctrl_weight_0_2/S_AXI]
connect_bd_intf_net [get_bd_intf_pins smartconnect_0/M07_AXI] [get_bd_intf_pins axi_bram_ctrl_weight_0_3/S_AXI]
connect_bd_intf_net [get_bd_intf_pins smartconnect_0/M08_AXI] [get_bd_intf_pins axi_bram_ctrl_weight_1_0/S_AXI]
connect_bd_intf_net [get_bd_intf_pins smartconnect_0/M09_AXI] [get_bd_intf_pins axi_bram_ctrl_weight_1_1/S_AXI]
connect_bd_intf_net [get_bd_intf_pins smartconnect_0/M10_AXI] [get_bd_intf_pins axi_bram_ctrl_weight_1_2/S_AXI]
connect_bd_intf_net [get_bd_intf_pins smartconnect_0/M11_AXI] [get_bd_intf_pins axi_bram_ctrl_weight_1_3/S_AXI]
connect_bd_intf_net [get_bd_intf_pins smartconnect_0/M12_AXI] [get_bd_intf_pins axi_bram_ctrl_weight_2_0/S_AXI]
connect_bd_intf_net [get_bd_intf_pins smartconnect_0/M13_AXI] [get_bd_intf_pins axi_bram_ctrl_weight_2_1/S_AXI]
connect_bd_intf_net [get_bd_intf_pins smartconnect_0/M14_AXI] [get_bd_intf_pins axi_bram_ctrl_weight_2_2/S_AXI]
connect_bd_intf_net [get_bd_intf_pins smartconnect_0/M15_AXI] [get_bd_intf_pins axi_bram_ctrl_weight_2_3/S_AXI]
connect_bd_intf_net [get_bd_intf_pins smartconnect_0/M16_AXI] [get_bd_intf_pins axi_bram_ctrl_weight_3_0/S_AXI]
connect_bd_intf_net [get_bd_intf_pins smartconnect_0/M17_AXI] [get_bd_intf_pins axi_bram_ctrl_weight_3_1/S_AXI]
connect_bd_intf_net [get_bd_intf_pins smartconnect_0/M18_AXI] [get_bd_intf_pins axi_bram_ctrl_weight_3_2/S_AXI]
connect_bd_intf_net [get_bd_intf_pins smartconnect_0/M19_AXI] [get_bd_intf_pins axi_bram_ctrl_weight_3_3/S_AXI]
connect_bd_intf_net [get_bd_intf_pins smartconnect_0/M20_AXI] [get_bd_intf_pins axi_bram_ctrl_img_0/S_AXI]
connect_bd_intf_net [get_bd_intf_pins smartconnect_0/M21_AXI] [get_bd_intf_pins axi_bram_ctrl_img_1/S_AXI]
connect_bd_intf_net [get_bd_intf_pins smartconnect_0/M22_AXI] [get_bd_intf_pins axi_bram_ctrl_img_2/S_AXI]
connect_bd_intf_net [get_bd_intf_pins smartconnect_0/M23_AXI] [get_bd_intf_pins axi_bram_ctrl_img_3/S_AXI]
connect_bd_intf_net [get_bd_intf_pins smartconnect_0/M24_AXI] [get_bd_intf_pins axi_bram_ctrl_0/S_AXI]
connect_bd_net -net BRAM_img_addr_0_1 [get_bd_pins axi_bram_ctrl_img_0/bram_addr_a] [get_bd_pins Core/BRAM_img_addr_0]
connect_bd_net -net BRAM_img_din_0_1 [get_bd_pins axi_bram_ctrl_img_0/bram_wrdata_a] [get_bd_pins Core/BRAM_img_din_0]
connect_bd_net -net BRAM_img_din_1_1 [get_bd_pins axi_bram_ctrl_img_1/bram_wrdata_a] [get_bd_pins Core/BRAM_img_din_1]
connect_bd_net -net BRAM_img_en_1_1 [get_bd_pins axi_bram_ctrl_img_1/bram_en_a] [get_bd_pins Core/BRAM_img_en_1]
connect_bd_net -net BRAM_img_rst_1_1 [get_bd_pins axi_bram_ctrl_img_1/bram_rst_a] [get_bd_pins Core/BRAM_img_rst_1]
connect_bd_net -net BRAM_img_wen_0_1 [get_bd_pins axi_bram_ctrl_img_0/bram_we_a] [get_bd_pins Core/BRAM_img_wen_0]
connect_bd_net -net BRAM_img_wen_1_1 [get_bd_pins axi_bram_ctrl_img_1/bram_we_a] [get_bd_pins Core/BRAM_img_wen_1]
connect_bd_net [get_bd_pins Core/BRAM_img_dout_0] [get_bd_pins axi_bram_ctrl_img_0/bram_rddata_a]
connect_bd_net [get_bd_pins Core/BRAM_img_dout_1] [get_bd_pins axi_bram_ctrl_img_1/bram_rddata_a]
connect_bd_net [get_bd_pins Core/BRAM_img_dout_2] [get_bd_pins axi_bram_ctrl_img_2/bram_rddata_a]
connect_bd_net [get_bd_pins Core/BRAM_img_dout_3] [get_bd_pins axi_bram_ctrl_img_3/bram_rddata_a]
connect_bd_net [get_bd_pins Core/end_core_out] [get_bd_pins regs_file_0/end_core_out]
connect_bd_net -net WxW_out_1 [get_bd_pins regs_file_0/WxW_out] [get_bd_pins Core/WxW_out]
connect_bd_net -net axi_bram_ctrl_20_bram_en_a [get_bd_pins axi_bram_ctrl_img_0/bram_en_a] [get_bd_pins Core/BRAM_img_en_0]
connect_bd_net -net axi_bram_ctrl_20_bram_rst_a [get_bd_pins axi_bram_ctrl_img_0/bram_rst_a] [get_bd_pins Core/BRAM_img_rst_0]
connect_bd_net -net axi_bram_ctrl_21_bram_addr_a [get_bd_pins axi_bram_ctrl_img_1/bram_addr_a] [get_bd_pins Core/BRAM_img_addr_1]
connect_bd_net -net axi_bram_ctrl_22_bram_addr_a [get_bd_pins axi_bram_ctrl_img_2/bram_addr_a] [get_bd_pins Core/BRAM_img_addr_2]
connect_bd_net -net axi_bram_ctrl_22_bram_en_a [get_bd_pins axi_bram_ctrl_img_2/bram_en_a] [get_bd_pins Core/BRAM_img_en_2]
connect_bd_net -net axi_bram_ctrl_22_bram_rst_a [get_bd_pins axi_bram_ctrl_img_2/bram_rst_a] [get_bd_pins Core/BRAM_img_rst_2]
connect_bd_net -net axi_bram_ctrl_22_bram_we_a [get_bd_pins axi_bram_ctrl_img_2/bram_we_a] [get_bd_pins Core/BRAM_img_wen_2]
connect_bd_net -net axi_bram_ctrl_22_bram_wrdata_a [get_bd_pins axi_bram_ctrl_img_2/bram_wrdata_a] [get_bd_pins Core/BRAM_img_din_2]
connect_bd_net -net axi_bram_ctrl_23_bram_addr_a [get_bd_pins axi_bram_ctrl_img_3/bram_addr_a] [get_bd_pins Core/BRAM_img_addr_3]
connect_bd_net -net axi_bram_ctrl_23_bram_en_a [get_bd_pins axi_bram_ctrl_img_3/bram_en_a] [get_bd_pins Core/BRAM_img_en_3]
connect_bd_net -net axi_bram_ctrl_23_bram_rst_a [get_bd_pins axi_bram_ctrl_img_3/bram_rst_a] [get_bd_pins Core/BRAM_img_rst_3]
connect_bd_net -net axi_bram_ctrl_23_bram_we_a [get_bd_pins axi_bram_ctrl_img_3/bram_we_a] [get_bd_pins Core/BRAM_img_wen_3]
connect_bd_net -net axi_bram_ctrl_23_bram_wrdata_a [get_bd_pins axi_bram_ctrl_img_3/bram_wrdata_a] [get_bd_pins Core/BRAM_img_din_3]
connect_bd_net [get_bd_pins processing_system7_0/FCLK_CLK0] \
  [get_bd_pins processing_system7_0/M_AXI_GP0_ACLK] [get_bd_pins ps7_0_axi_periph/S00_ACLK] \
  [get_bd_pins rst_ps7_0_100M/slowest_sync_clk] [get_bd_pins axi_cdma_0/s_axi_lite_aclk] \
  [get_bd_pins ps7_0_axi_periph/M00_ACLK] [get_bd_pins ps7_0_axi_periph/ACLK] [get_bd_pins axi_cdma_0/m_axi_aclk] \
  [get_bd_pins smartconnect_0/aclk] [get_bd_pins axi_bram_ctrl_out_0/s_axi_aclk] [get_bd_pins axi_bram_ctrl_out_1/s_axi_aclk] \
  [get_bd_pins axi_bram_ctrl_out_2/s_axi_aclk] [get_bd_pins axi_bram_ctrl_out_3/s_axi_aclk] \
  [get_bd_pins axi_bram_ctrl_weight_0_0/s_axi_aclk] [get_bd_pins axi_bram_ctrl_weight_0_1/s_axi_aclk] \
  [get_bd_pins axi_bram_ctrl_weight_0_2/s_axi_aclk] [get_bd_pins axi_bram_ctrl_weight_0_3/s_axi_aclk] \
  [get_bd_pins axi_bram_ctrl_weight_1_0/s_axi_aclk] [get_bd_pins axi_bram_ctrl_weight_1_1/s_axi_aclk] \
  [get_bd_pins axi_bram_ctrl_weight_1_2/s_axi_aclk] [get_bd_pins axi_bram_ctrl_weight_1_3/s_axi_aclk] \
  [get_bd_pins axi_bram_ctrl_weight_2_0/s_axi_aclk] [get_bd_pins axi_bram_ctrl_weight_2_1/s_axi_aclk] \
  [get_bd_pins axi_bram_ctrl_weight_2_2/s_axi_aclk] [get_bd_pins axi_bram_ctrl_weight_2_3/s_axi_aclk] \
  [get_bd_pins axi_bram_ctrl_weight_3_0/s_axi_aclk] [get_bd_pins axi_bram_ctrl_weight_3_1/s_axi_aclk] \
  [get_bd_pins axi_bram_ctrl_weight_3_2/s_axi_aclk] [get_bd_pins axi_bram_ctrl_weight_3_3/s_axi_aclk] \
  [get_bd_pins axi_bram_ctrl_img_0/s_axi_aclk] [get_bd_pins axi_bram_ctrl_img_1/s_axi_aclk] \
  [get_bd_pins axi_bram_ctrl_img_2/s_axi_aclk] [get_bd_pins axi_bram_ctrl_img_3/s_axi_aclk] \
  [get_bd_pins ps7_0_axi_periph/M01_ACLK] [get_bd_pins Core/clk] [get_bd_pins regs_file_0/S_AXI_ACLK] \
  [get_bd_pins axi_bram_ctrl_0/s_axi_aclk]
connect_bd_net [get_bd_pins processing_system7_0/FCLK_RESET0_N] [get_bd_pins rst_ps7_0_100M/ext_reset_in]
connect_bd_net [get_bd_pins regs_file_0/BRAM_img_sel] [get_bd_pins Core/BRAM_img_sel]
connect_bd_net [get_bd_pins regs_file_0/channel_input_img] [get_bd_pins Core/channel_input_img]
connect_bd_net [get_bd_pins regs_file_0/no_channel_out] [get_bd_pins Core/no_channel_out]
connect_bd_net [get_bd_pins regs_file_0/stride] [get_bd_pins Core/stride]
connect_bd_net -net rst_1 [get_bd_pins regs_file_0/rst] [get_bd_pins Core/rst]
connect_bd_net [get_bd_pins rst_ps7_0_100M/peripheral_aresetn] \
  [get_bd_pins ps7_0_axi_periph/S00_ARESETN] [get_bd_pins axi_cdma_0/s_axi_lite_aresetn] \
  [get_bd_pins ps7_0_axi_periph/M00_ARESETN] [get_bd_pins ps7_0_axi_periph/ARESETN] \
  [get_bd_pins axi_bram_ctrl_out_0/s_axi_aresetn] [get_bd_pins smartconnect_0/aresetn] \
  [get_bd_pins axi_bram_ctrl_out_1/s_axi_aresetn] [get_bd_pins axi_bram_ctrl_out_2/s_axi_aresetn] \
  [get_bd_pins axi_bram_ctrl_out_3/s_axi_aresetn] [get_bd_pins axi_bram_ctrl_weight_0_0/s_axi_aresetn] \
  [get_bd_pins axi_bram_ctrl_weight_0_1/s_axi_aresetn] [get_bd_pins axi_bram_ctrl_weight_0_2/s_axi_aresetn] \
  [get_bd_pins axi_bram_ctrl_weight_0_3/s_axi_aresetn] [get_bd_pins axi_bram_ctrl_weight_1_0/s_axi_aresetn] \
  [get_bd_pins axi_bram_ctrl_weight_1_1/s_axi_aresetn] [get_bd_pins axi_bram_ctrl_weight_1_2/s_axi_aresetn] \
  [get_bd_pins axi_bram_ctrl_weight_1_3/s_axi_aresetn] [get_bd_pins axi_bram_ctrl_weight_2_0/s_axi_aresetn] \
  [get_bd_pins axi_bram_ctrl_weight_2_1/s_axi_aresetn] [get_bd_pins axi_bram_ctrl_weight_2_2/s_axi_aresetn] \
  [get_bd_pins axi_bram_ctrl_weight_2_3/s_axi_aresetn] [get_bd_pins axi_bram_ctrl_weight_3_0/s_axi_aresetn] \
  [get_bd_pins axi_bram_ctrl_weight_3_1/s_axi_aresetn] [get_bd_pins axi_bram_ctrl_weight_3_2/s_axi_aresetn] \
  [get_bd_pins axi_bram_ctrl_weight_3_3/s_axi_aresetn] [get_bd_pins axi_bram_ctrl_img_0/s_axi_aresetn] \
  [get_bd_pins axi_bram_ctrl_img_1/s_axi_aresetn] [get_bd_pins axi_bram_ctrl_img_2/s_axi_aresetn] \
  [get_bd_pins axi_bram_ctrl_img_3/s_axi_aresetn] [get_bd_pins ps7_0_axi_periph/M01_ARESETN] \
  [get_bd_pins regs_file_0/S_AXI_ARESETN] [get_bd_pins axi_bram_ctrl_0/s_axi_aresetn]
connect_bd_net -net start_core_in_1 [get_bd_pins regs_file_0/start_core_in] [get_bd_pins Core/start_core_in]
connect_bd_net -net weight_size_1_16_1 [get_bd_pins regs_file_0/weight_size_1_16] [get_bd_pins Core/weight_size_1_16]
connect_bd_net -net width_input_img_1 [get_bd_pins regs_file_0/width_input_img] [get_bd_pins Core/width_input_img]

# ---- address map ----
assign_bd_address -offset 0xC0000000 -range 4K -target_address_space [get_bd_addr_spaces axi_cdma_0/Data] [get_bd_addr_segs axi_bram_ctrl_out_0/S_AXI/Mem0]
assign_bd_address -offset 0xC0001000 -range 4K -target_address_space [get_bd_addr_spaces axi_cdma_0/Data] [get_bd_addr_segs axi_bram_ctrl_out_1/S_AXI/Mem0]
assign_bd_address -offset 0xC0002000 -range 4K -target_address_space [get_bd_addr_spaces axi_cdma_0/Data] [get_bd_addr_segs axi_bram_ctrl_out_2/S_AXI/Mem0]
assign_bd_address -offset 0xC0003000 -range 4K -target_address_space [get_bd_addr_spaces axi_cdma_0/Data] [get_bd_addr_segs axi_bram_ctrl_out_3/S_AXI/Mem0]
assign_bd_address -offset 0xC2000000 -range 8K -target_address_space [get_bd_addr_spaces axi_cdma_0/Data] [get_bd_addr_segs axi_bram_ctrl_0/S_AXI/Mem0]
assign_bd_address -offset 0xC8000000 -range 4K -target_address_space [get_bd_addr_spaces axi_cdma_0/Data] [get_bd_addr_segs axi_bram_ctrl_weight_0_0/S_AXI/Mem0]
assign_bd_address -offset 0xC8001000 -range 4K -target_address_space [get_bd_addr_spaces axi_cdma_0/Data] [get_bd_addr_segs axi_bram_ctrl_weight_0_1/S_AXI/Mem0]
assign_bd_address -offset 0xC8002000 -range 4K -target_address_space [get_bd_addr_spaces axi_cdma_0/Data] [get_bd_addr_segs axi_bram_ctrl_weight_0_2/S_AXI/Mem0]
assign_bd_address -offset 0xC8003000 -range 4K -target_address_space [get_bd_addr_spaces axi_cdma_0/Data] [get_bd_addr_segs axi_bram_ctrl_weight_0_3/S_AXI/Mem0]
assign_bd_address -offset 0xC8004000 -range 4K -target_address_space [get_bd_addr_spaces axi_cdma_0/Data] [get_bd_addr_segs axi_bram_ctrl_weight_1_0/S_AXI/Mem0]
assign_bd_address -offset 0xC8005000 -range 4K -target_address_space [get_bd_addr_spaces axi_cdma_0/Data] [get_bd_addr_segs axi_bram_ctrl_weight_1_1/S_AXI/Mem0]
assign_bd_address -offset 0xC8006000 -range 4K -target_address_space [get_bd_addr_spaces axi_cdma_0/Data] [get_bd_addr_segs axi_bram_ctrl_weight_1_2/S_AXI/Mem0]
assign_bd_address -offset 0xC8007000 -range 4K -target_address_space [get_bd_addr_spaces axi_cdma_0/Data] [get_bd_addr_segs axi_bram_ctrl_weight_1_3/S_AXI/Mem0]
assign_bd_address -offset 0xC8008000 -range 4K -target_address_space [get_bd_addr_spaces axi_cdma_0/Data] [get_bd_addr_segs axi_bram_ctrl_weight_2_0/S_AXI/Mem0]
assign_bd_address -offset 0xC8009000 -range 4K -target_address_space [get_bd_addr_spaces axi_cdma_0/Data] [get_bd_addr_segs axi_bram_ctrl_weight_2_1/S_AXI/Mem0]
assign_bd_address -offset 0xC800A000 -range 4K -target_address_space [get_bd_addr_spaces axi_cdma_0/Data] [get_bd_addr_segs axi_bram_ctrl_weight_2_2/S_AXI/Mem0]
assign_bd_address -offset 0xC800B000 -range 4K -target_address_space [get_bd_addr_spaces axi_cdma_0/Data] [get_bd_addr_segs axi_bram_ctrl_weight_2_3/S_AXI/Mem0]
assign_bd_address -offset 0xC800C000 -range 4K -target_address_space [get_bd_addr_spaces axi_cdma_0/Data] [get_bd_addr_segs axi_bram_ctrl_weight_3_0/S_AXI/Mem0]
assign_bd_address -offset 0xC800D000 -range 4K -target_address_space [get_bd_addr_spaces axi_cdma_0/Data] [get_bd_addr_segs axi_bram_ctrl_weight_3_1/S_AXI/Mem0]
assign_bd_address -offset 0xC800E000 -range 4K -target_address_space [get_bd_addr_spaces axi_cdma_0/Data] [get_bd_addr_segs axi_bram_ctrl_weight_3_2/S_AXI/Mem0]
assign_bd_address -offset 0xC800F000 -range 4K -target_address_space [get_bd_addr_spaces axi_cdma_0/Data] [get_bd_addr_segs axi_bram_ctrl_weight_3_3/S_AXI/Mem0]
assign_bd_address -offset 0xE8000000 -range 4K -target_address_space [get_bd_addr_spaces axi_cdma_0/Data] [get_bd_addr_segs axi_bram_ctrl_img_0/S_AXI/Mem0]
assign_bd_address -offset 0xE8001000 -range 4K -target_address_space [get_bd_addr_spaces axi_cdma_0/Data] [get_bd_addr_segs axi_bram_ctrl_img_1/S_AXI/Mem0]
assign_bd_address -offset 0xE8002000 -range 4K -target_address_space [get_bd_addr_spaces axi_cdma_0/Data] [get_bd_addr_segs axi_bram_ctrl_img_2/S_AXI/Mem0]
assign_bd_address -offset 0xE8003000 -range 4K -target_address_space [get_bd_addr_spaces axi_cdma_0/Data] [get_bd_addr_segs axi_bram_ctrl_img_3/S_AXI/Mem0]
assign_bd_address -offset 0x43C00000 -range 64K -target_address_space [get_bd_addr_spaces processing_system7_0/Data] [get_bd_addr_segs regs_file_0/S_AXI/reg0]
assign_bd_address -offset 0x7E200000 -range 64K -target_address_space [get_bd_addr_spaces processing_system7_0/Data] [get_bd_addr_segs axi_cdma_0/S_AXI_LITE/Reg]

validate_bd_design
save_bd_design
